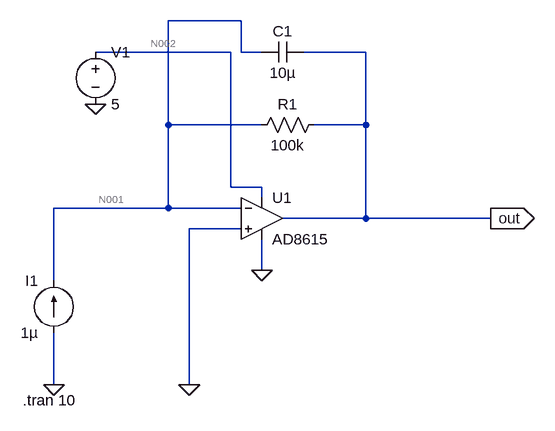
[diagram p0: schematic Draft1.asc]
Draft1.asc, the LTspice schematic file:
Version 4.1
SHEET 1 880 680
WIRE -432 -240 -544 -240
WIRE -448 -192 -656 -192
WIRE -432 -192 -432 -240
WIRE -400 -192 -432 -192
WIRE -240 -192 -336 -192
WIRE -544 -80 -544 -240
WIRE -400 -80 -544 -80
WIRE -240 -80 -240 -192
WIRE -240 -80 -320 -80
WIRE -448 16 -448 -192
WIRE -400 16 -448 16
WIRE -400 32 -400 16
WIRE -544 48 -544 -80
WIRE -544 48 -720 48
WIRE -432 48 -544 48
WIRE -240 64 -240 -80
WIRE -240 64 -368 64
WIRE -48 64 -240 64
WIRE -432 80 -512 80
WIRE -400 144 -400 96
WIRE -720 160 -720 48
WIRE -720 320 -720 240
WIRE -512 320 -512 80
FLAG -720 320 0
FLAG -512 320 0
FLAG -656 -112 0
FLAG -400 144 0
FLAG -48 64 out
IOPIN -48 64 Out
SYMBOL current -720 240 R180
WINDOW 0 24 80 Left 2
WINDOW 3 24 0 Left 2
WINDOW 123 0 0 Left 0
WINDOW 39 0 0 Left 0
SYMATTR InstName I1
SYMATTR Value 1µ
SYMBOL res -304 -96 R90
WINDOW 0 0 56 VBottom 2
WINDOW 3 32 56 VTop 2
SYMATTR InstName R1
SYMATTR Value 100k
SYMBOL voltage -656 -208 R0
WINDOW 123 0 0 Left 0
WINDOW 39 0 0 Left 0
SYMATTR InstName V1
SYMATTR Value 5
SYMBOL OpAmps\\AD8615 -400 0 R0
SYMATTR InstName U1
SYMBOL cap -336 -208 R90
WINDOW 0 0 32 VBottom 2
WINDOW 3 32 32 VTop 2
SYMATTR InstName C1
SYMATTR Value 10µ
TEXT -768 344 Left 2 !.tran 10

The netlist it stands for:
* Draft1.asc
I1 0 N001 1µ
R1 out N001 100k
V1 N002 0 5
X§U1 0 N001 N002 0 out AD8615  ; pins In+ In- V+ V- OUT
C1 out N001 10µ
.tran 10
.backanno
.end

* Results of the author's LTspice run, read from the files saved beside the schematic
* Operating Point, zero values left out:
*   V(n001) = 100.1 mV
*   V(n002) = 5 V
*   V(out) = 145.9 µV
*   I(I1) = 1 µA
*   I(R1) = -1 µA
*   I(V1) = -1.707 mA
*   Ix(u1:1) = 6.438 pA
*   Ix(u1:2) = 6.536 pA
*   Ix(u1:3) = 1.707 mA
*   Ix(u1:4) = -1.707 mA
*   Ix(u1:5) = 1 µA